# Altium schematic sheet EL.MBRD.T01.SchDoc
size A3; SheetNumber: 1; SheetTotal: 7
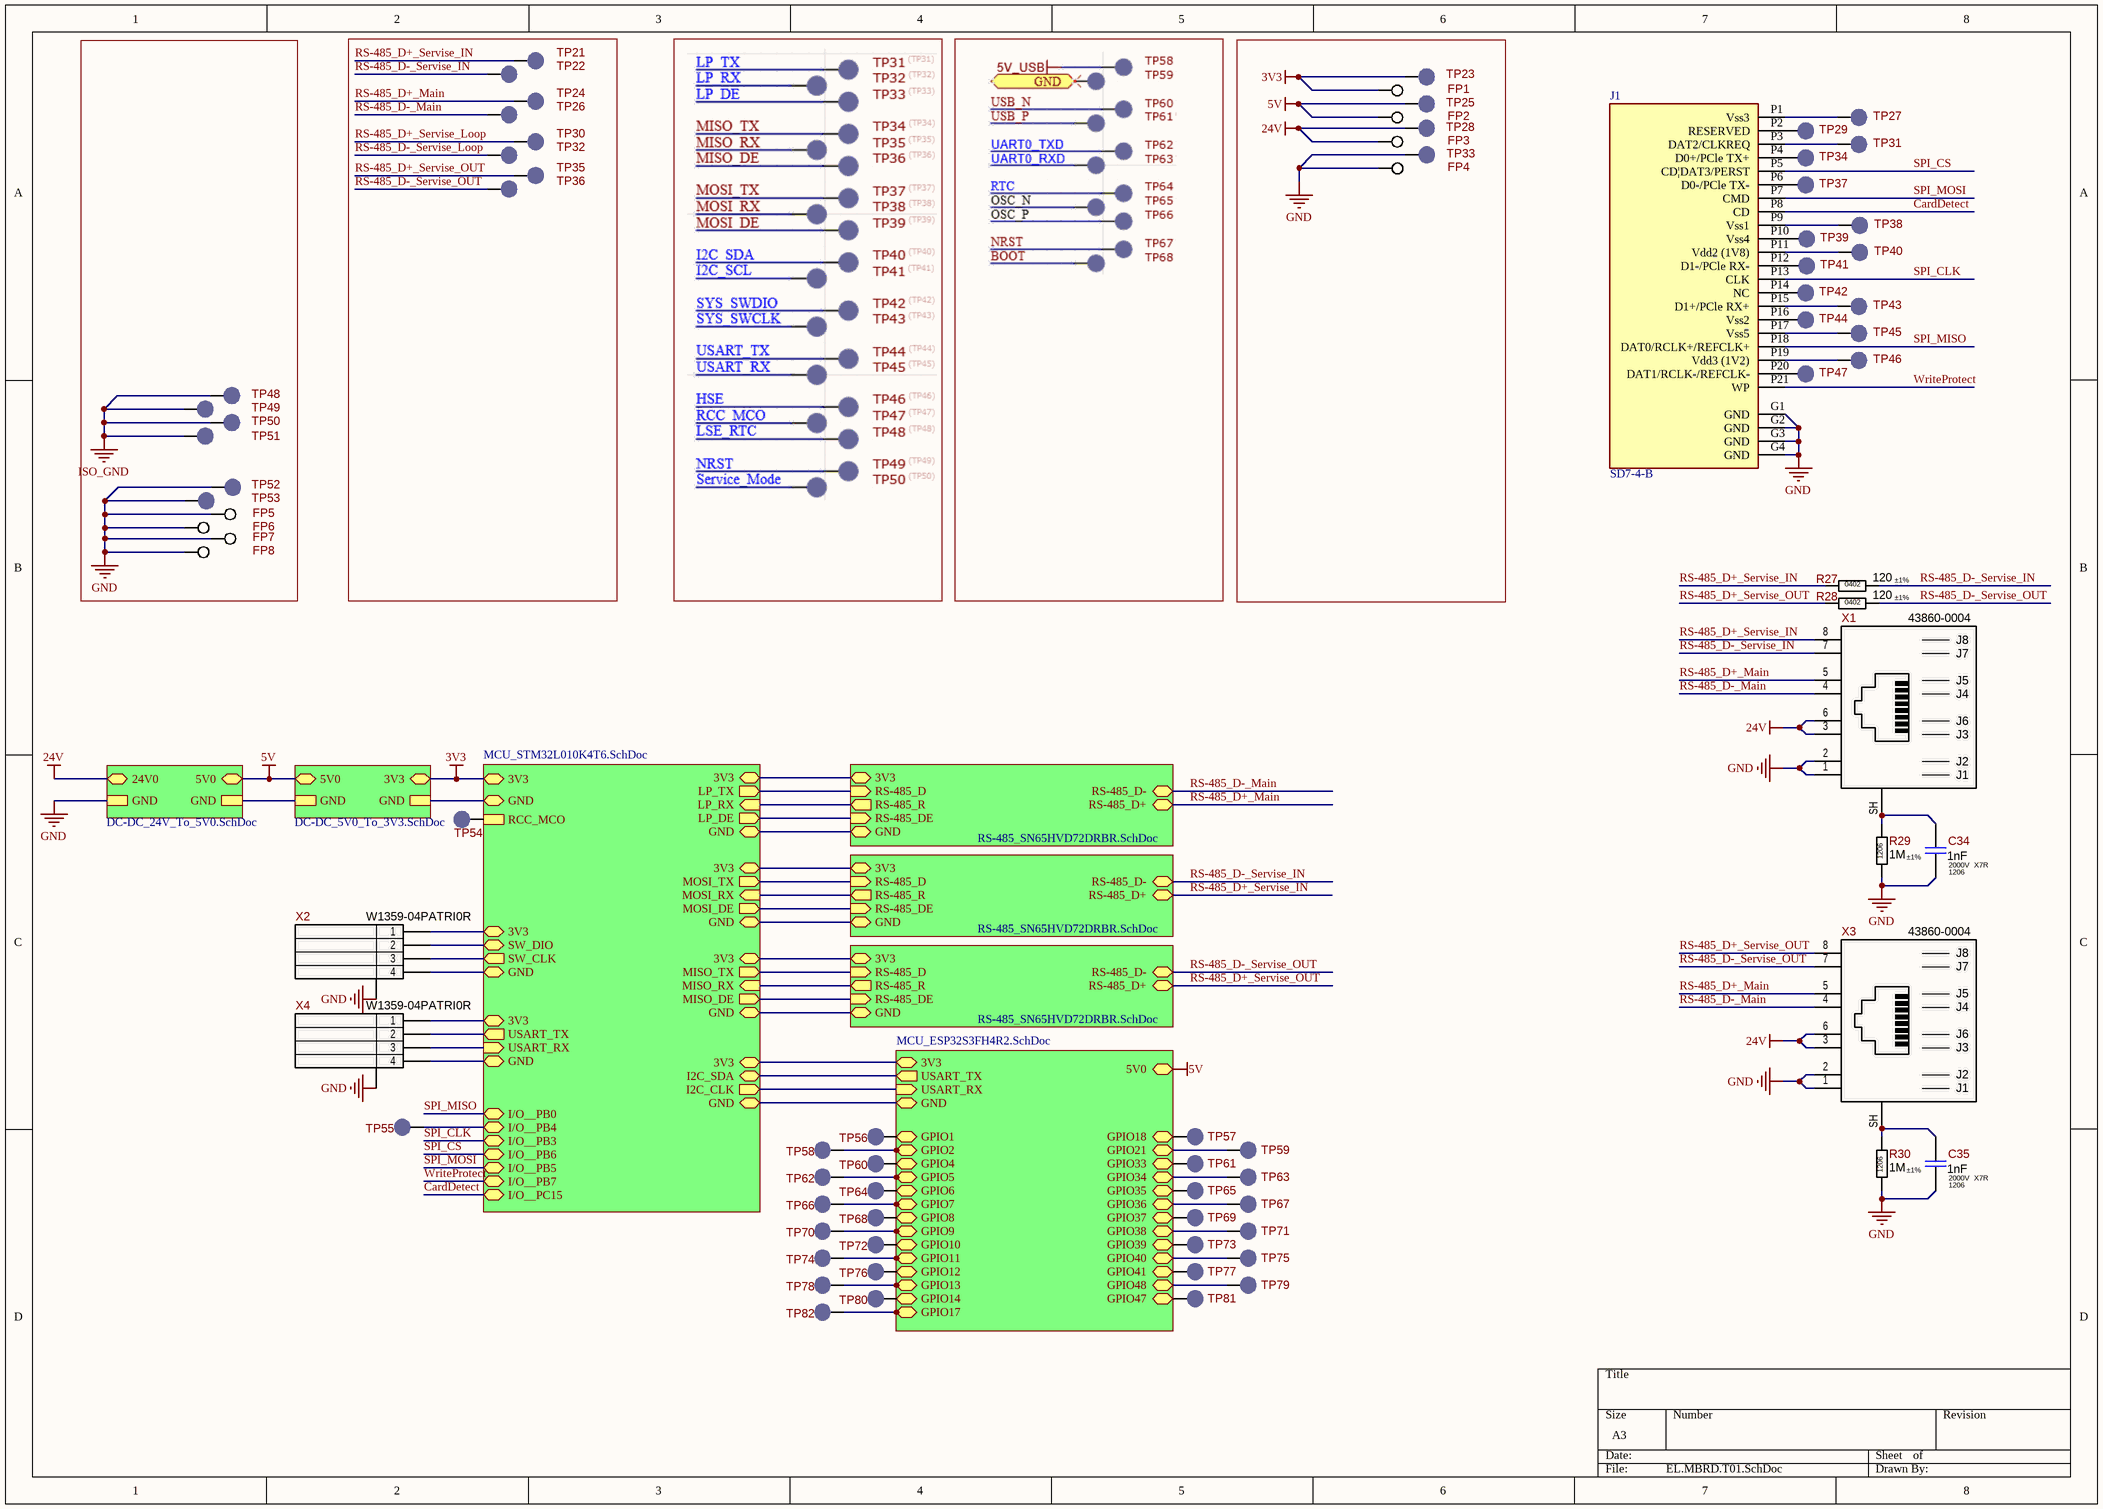
[diagram p0: EL.MBRD.T01.SchDoc]

## Parts
C34  Package: 1206  Voltage: 2000V  Dielectric Type: X7R  [CAP-1206(3216)X125T20]  (hidden comment: 1nF)
C35  Package: 1206  Voltage: 2000V  Dielectric Type: X7R  [CAP-1206(3216)X125T20]  (hidden comment: 1nF)
FP1  PAD-1.1mm  [PAD-1.1mm]  (value not drawn)  (no BOM)
FP2  PAD-1.1mm  [PAD-1.1mm]  (value not drawn)  (no BOM)
FP3  PAD-1.1mm  [PAD-1.1mm]  (value not drawn)  (no BOM)
FP4  PAD-1.1mm  [PAD-1.1mm]  (value not drawn)  (no BOM)
FP5  PAD-1.1mm  [PAD-1.1mm]  (value not drawn)  (no BOM)
FP6  PAD-1.1mm  [PAD-1.1mm]  (value not drawn)  (no BOM)
FP7  PAD-1.1mm  [PAD-1.1mm]  (value not drawn)  (no BOM)
FP8  PAD-1.1mm  [PAD-1.1mm]  (value not drawn)  (no BOM)
J1  SD7-4-B  [SAMESKY_SD7-4-B]
R27  Tolerance: ±1%  Package: 0402  [R_ANY_CHIP_0402_HI]  (hidden comment: 120)
R28  Tolerance: ±1%  Package: 0402  [R_ANY_CHIP_0402_HI]  (hidden comment: 120)
R29  Tolerance: ±1%  Package: 1206  [CHV1206-Series]  (hidden comment: 1M)
R30  Tolerance: ±1%  Package: 1206  [CHV1206-Series]  (hidden comment: 1M)
TP21  LED_LINK  [TP_SMD_2mm]  (value not drawn)  (no BOM)
TP22  LED_LINK  [TP_SMD_2mm]  (value not drawn)  (no BOM)
TP23  LED_LINK  [TP_SMD_2mm]  (value not drawn)  (no BOM)
TP24  LED_LINK  [TP_SMD_2mm]  (value not drawn)  (no BOM)
TP25  LED_LINK  [TP_SMD_2mm]  (value not drawn)  (no BOM)
TP26  LED_LINK  [TP_SMD_2mm]  (value not drawn)  (no BOM)
TP27  LED_LINK  [TP_SMD_2mm]  (value not drawn)  (no BOM)
TP28  LED_LINK  [TP_SMD_2mm]  (value not drawn)  (no BOM)
TP29  LED_LINK  [TP_SMD_2mm]  (value not drawn)  (no BOM)
TP30  LED_LINK  [TP_SMD_2mm]  (value not drawn)  (no BOM)
TP31  LED_LINK  [TP_SMD_2mm]  (value not drawn)  (no BOM)
TP32  LED_LINK  [TP_SMD_2mm]  (value not drawn)  (no BOM)
TP33  LED_LINK  [TP_SMD_2mm]  (value not drawn)  (no BOM)
TP34  LED_LINK  [TP_SMD_2mm]  (value not drawn)  (no BOM)
TP35  LED_LINK  [TP_SMD_2mm]  (value not drawn)  (no BOM)
TP36  LED_LINK  [TP_SMD_2mm]  (value not drawn)  (no BOM)
TP37  LED_LINK  [TP_SMD_2mm]  (value not drawn)  (no BOM)
TP38  LED_LINK  [TP_SMD_2mm]  (value not drawn)  (no BOM)
TP39  LED_LINK  [TP_SMD_2mm]  (value not drawn)  (no BOM)
TP40  LED_LINK  [TP_SMD_2mm]  (value not drawn)  (no BOM)
TP41  LED_LINK  [TP_SMD_2mm]  (value not drawn)  (no BOM)
TP42  LED_LINK  [TP_SMD_2mm]  (value not drawn)  (no BOM)
TP43  LED_LINK  [TP_SMD_2mm]  (value not drawn)  (no BOM)
TP44  LED_LINK  [TP_SMD_2mm]  (value not drawn)  (no BOM)
TP45  LED_LINK  [TP_SMD_2mm]  (value not drawn)  (no BOM)
TP46  LED_LINK  [TP_SMD_2mm]  (value not drawn)  (no BOM)
TP47  LED_LINK  [TP_SMD_2mm]  (value not drawn)  (no BOM)
TP48  LED_LINK  [TP_SMD_2mm]  (value not drawn)  (no BOM)
TP49  LED_LINK  [TP_SMD_2mm]  (value not drawn)  (no BOM)
TP50  LED_LINK  [TP_SMD_2mm]  (value not drawn)  (no BOM)
TP51  LED_LINK  [TP_SMD_2mm]  (value not drawn)  (no BOM)
TP52  LED_LINK  [TP_SMD_2mm]  (value not drawn)  (no BOM)
TP53  LED_LINK  [TP_SMD_2mm]  (value not drawn)  (no BOM)
TP54  LED_LINK  [TP_SMD_2mm]  (value not drawn)  (no BOM)
TP55  LED_LINK  [TP_SMD_2mm]  (value not drawn)  (no BOM)
TP56  LED_LINK  [TP_SMD_2mm]  (value not drawn)  (no BOM)
TP57  LED_LINK  [TP_SMD_2mm]  (value not drawn)  (no BOM)
TP58  LED_LINK  [TP_SMD_2mm]  (value not drawn)  (no BOM)
TP59  LED_LINK  [TP_SMD_2mm]  (value not drawn)  (no BOM)
TP60  LED_LINK  [TP_SMD_2mm]  (value not drawn)  (no BOM)
TP61  LED_LINK  [TP_SMD_2mm]  (value not drawn)  (no BOM)
TP62  LED_LINK  [TP_SMD_2mm]  (value not drawn)  (no BOM)
TP63  LED_LINK  [TP_SMD_2mm]  (value not drawn)  (no BOM)
TP64  LED_LINK  [TP_SMD_2mm]  (value not drawn)  (no BOM)
TP65  LED_LINK  [TP_SMD_2mm]  (value not drawn)  (no BOM)
TP66  LED_LINK  [TP_SMD_2mm]  (value not drawn)  (no BOM)
TP67  LED_LINK  [TP_SMD_2mm]  (value not drawn)  (no BOM)
TP68  LED_LINK  [TP_SMD_2mm]  (value not drawn)  (no BOM)
TP69  LED_LINK  [TP_SMD_2mm]  (value not drawn)  (no BOM)
TP70  LED_LINK  [TP_SMD_2mm]  (value not drawn)  (no BOM)
TP71  LED_LINK  [TP_SMD_2mm]  (value not drawn)  (no BOM)
TP72  LED_LINK  [TP_SMD_2mm]  (value not drawn)  (no BOM)
TP73  LED_LINK  [TP_SMD_2mm]  (value not drawn)  (no BOM)
TP74  LED_LINK  [TP_SMD_2mm]  (value not drawn)  (no BOM)
TP75  LED_LINK  [TP_SMD_2mm]  (value not drawn)  (no BOM)
TP76  LED_LINK  [TP_SMD_2mm]  (value not drawn)  (no BOM)
TP77  LED_LINK  [TP_SMD_2mm]  (value not drawn)  (no BOM)
TP78  LED_LINK  [TP_SMD_2mm]  (value not drawn)  (no BOM)
TP79  LED_LINK  [TP_SMD_2mm]  (value not drawn)  (no BOM)
TP80  LED_LINK  [TP_SMD_2mm]  (value not drawn)  (no BOM)
TP81  LED_LINK  [TP_SMD_2mm]  (value not drawn)  (no BOM)
TP82  LED_LINK  [TP_SMD_2mm]  (value not drawn)  (no BOM)
X1  43860-0004  [43860-0004]
X2  W1359-04PATRI0R  [W1359-04PATXI0R_DBG]
X3  43860-0004  [43860-0004]
X4  W1359-04PATRI0R  [W1359-04PATXI0R_DBG]

## Sub-sheets
LDO_3V3 = DC-DC_5V0_To_3V3.SchDoc: 3V3 (bidir), 5V0 (bidir), GND, GND
LDO_3V3 = DC-DC_24V_To_5V0.SchDoc: 5V0 (bidir), 24V0 (bidir), GND, GND
MCU = MCU_STM32L010K4T6.SchDoc: LP_TX (out), LP_RX (in), LP_DE (out), MISO_TX (out), MISO_RX (in), MISO_DE (out), MOSI_RX (in), MOSI_TX (out), MOSI_DE (out), I2C_SDA (bidir), I2C_CLK (out), SW_DIO (bidir), SW_CLK (out), USART_TX (out), USART_RX (in), RCC_MCO, I/O__PB0 (bidir), I/O__PB3 (bidir), I/O__PB4 (bidir), I/O__PB5 (bidir), I/O__PB6 (bidir), I/O__PB7 (bidir), I/O__PC15 (bidir), 3V3 (bidir), 3V3 (bidir), 3V3 (bidir), 3V3 (bidir), 3V3 (bidir), GND (bidir), GND (bidir), GND (bidir), GND (bidir), GND (bidir), GND (bidir), GND (bidir), 3V3 (bidir), 3V3 (bidir)
MCU = MCU_ESP32S3FH4R2.SchDoc: USART_TX (out), USART_RX (in), 5V0 (bidir), GPIO1 (bidir), GPIO4 (bidir), GPIO2 (bidir), GPIO6 (bidir), GPIO5 (bidir), GPIO7 (bidir), GPIO8 (bidir), 3V3 (bidir), GND (bidir), GPIO9 (bidir), GPIO11 (bidir), GPIO10 (bidir), GPIO13 (bidir), GPIO12 (bidir), GPIO14 (bidir), GPIO17 (bidir), GPIO18 (bidir), GPIO33 (bidir), GPIO21 (bidir), GPIO35 (bidir), GPIO34 (bidir), GPIO36 (bidir), GPIO37 (bidir), GPIO38 (bidir), GPIO40 (bidir), GPIO39 (bidir), GPIO48 (bidir), GPIO41 (bidir), GPIO47 (bidir)
RS-485 = RS-485_SN65HVD72DRBR.SchDoc: 3V3 (bidir), RS-485_D+ (bidir), RS-485_D- (bidir), RS-485_R (out), RS-485_D (in), RS-485_DE (in), GND (bidir)
RS-485 = RS-485_SN65HVD72DRBR.SchDoc: 3V3 (bidir), RS-485_D+ (bidir), RS-485_D- (bidir), RS-485_R (out), RS-485_D (in), RS-485_DE (in), GND (bidir)
RS-485 = RS-485_SN65HVD72DRBR.SchDoc: 3V3 (bidir), RS-485_D+ (bidir), RS-485_D- (bidir), RS-485_R (out), RS-485_D (in), RS-485_DE (in), GND (bidir)

## Nets
3V3: FP1.1 TP23.1 ; sheet LDO_3V3/3V3, sheet MCU/3V3
5V: FP2.1 TP25.1 ; sheet LDO_3V3/5V0, sheet LDO_3V3/5V0
24V: FP3.1 TP28.1 X1.3(TD3-) X1.6(CT) X3.3(TD3-) X3.6(CT) ; sheet LDO_3V3/24V0
GND: C34.2 C35.2 FP4.1 FP5.1 FP6.1 FP7.1 FP8.1 J1.G1(GND) J1.G2(GND) J1.G3(GND) J1.G4(GND) R29.2 R30.2 TP33.1 TP52.1 TP53.1 X1.1(TD4-) X1.2(TD4+) X2.MP(MountPad) X3.1(TD4-) X3.2(TD4+) X4.MP(MountPad) ; sheet LDO_3V3/GND
ISO_GND: TP48.1 TP49.1 TP50.1 TP51.1
CardDetect: J1.P8(CD) ; sheet MCU/I/O__PC15
RS-485_D+_Main: TP24.1 X1.5(CT) X3.5(CT) ; sheet RS-485/RS-485_D+
RS-485_D+_Servise_IN: R27.1 TP21.1 X1.8(TD2+) ; sheet RS-485/RS-485_D+
RS-485_D+_Servise_Loop: TP30.1
RS-485_D+_Servise_OUT: R28.1 TP35.1 X3.8(TD2+) ; sheet RS-485/RS-485_D+
RS-485_D-_Main: TP26.1 X1.4(TD3+) X3.4(TD3+) ; sheet RS-485/RS-485_D-
RS-485_D-_Servise_IN: R27.2 TP22.1 X1.7(TD2-) ; sheet RS-485/RS-485_D-
RS-485_D-_Servise_Loop: TP32.1
RS-485_D-_Servise_OUT: R28.2 TP36.1 X3.7(TD2-) ; sheet RS-485/RS-485_D-
SPI_CLK: J1.P13(CLK) ; sheet MCU/I/O__PB3
SPI_CS: J1.P5(CD|DAT3/PERST) ; sheet MCU/I/O__PB6
SPI_MISO: J1.P18(DAT0/RCLK+/REFCLK+) ; sheet MCU/I/O__PB0
SPI_MOSI: sheet MCU/I/O__PB5
WriteProtect: J1.P21(WP) ; sheet MCU/I/O__PB7
NetC34_1: C34.1 R29.1 X1.SH(Shield)
NetC35_1: C35.1 R30.1 X3.SH(Shield)
NetJ1_P1: J1.P1(Vss3) TP27.1
NetJ1_P3: J1.P3(DAT2/CLKREQ) TP31.1
NetJ1_P10: J1.P10(Vss4) TP39.1
NetJ1_P12: J1.P12(D1-/PCle_RX-) TP41.1
NetJ1_P15: J1.P15(D1+/PCle_RX+) TP43.1
NetJ1_P17: J1.P17(Vss5) TP45.1
NetJ1_P19: J1.P19(Vdd3_(1V2)) TP46.1
NetTP54_1: TP54.1 ; sheet MCU/RCC_MCO
NetTP55_1: TP55.1 ; sheet MCU/I/O__PB4
NetTP58_1: TP58.1 ; sheet MCU/GPIO2
NetTP62_1: TP62.1 ; sheet MCU/GPIO5
NetTP66_1: TP66.1 ; sheet MCU/GPIO7
NetTP70_1: TP70.1 ; sheet MCU/GPIO9
NetTP74_1: TP74.1 ; sheet MCU/GPIO11
NetTP78_1: TP78.1 ; sheet MCU/GPIO13
NetTP82_1: TP82.1 ; sheet MCU/GPIO17
NetX2_1: X2.1 ; sheet MCU/3V3
NetX2_2: X2.2 ; sheet MCU/SW_DIO
NetX2_3: X2.3 ; sheet MCU/SW_CLK
NetX2_4: X2.4 ; sheet MCU/GND
NetX4_1: X4.1 ; sheet MCU/3V3
NetX4_2: X4.2 ; sheet MCU/USART_TX
NetX4_3: X4.3 ; sheet MCU/USART_RX
NetX4_4: X4.4 ; sheet MCU/GND
(unnamed): sheet LDO_3V3/GND, sheet MCU/GND
(unnamed): sheet LDO_3V3/GND, sheet LDO_3V3/GND
(unnamed): sheet MCU/LP_TX, sheet RS-485/RS-485_D
(unnamed): sheet MCU/LP_RX, sheet RS-485/RS-485_R
(unnamed): sheet MCU/LP_DE, sheet RS-485/RS-485_DE
(unnamed): sheet MCU/MISO_TX, sheet RS-485/RS-485_D
(unnamed): sheet MCU/MISO_RX, sheet RS-485/RS-485_R
(unnamed): sheet MCU/MISO_DE, sheet RS-485/RS-485_DE
(unnamed): sheet MCU/MOSI_RX, sheet RS-485/RS-485_R
(unnamed): sheet MCU/MOSI_TX, sheet RS-485/RS-485_D
(unnamed): sheet MCU/MOSI_DE, sheet RS-485/RS-485_DE
(unnamed): sheet MCU/I2C_SDA, sheet MCU/USART_TX
(unnamed): sheet MCU/I2C_CLK, sheet MCU/USART_RX
(unnamed): sheet MCU/3V3, sheet RS-485/3V3
(unnamed): sheet MCU/3V3, sheet RS-485/3V3
(unnamed): sheet MCU/GND, sheet RS-485/GND
(unnamed): sheet MCU/GND, sheet RS-485/GND
(unnamed): sheet MCU/GND, sheet MCU/GND
(unnamed): sheet MCU/GND, sheet RS-485/GND
(unnamed): sheet MCU/3V3, sheet RS-485/3V3
(unnamed): sheet MCU/3V3, sheet MCU/3V3

Not connected (* = marked no-connect by the designer): J1 P2(RESERVED) P4(D0+/PCle_TX+) P6(D0-/PCle_TX-) P7(CMD) P9(Vss1) P11(Vdd2_(1V8)) P14(NC) P16(Vss2) P20(DAT1/RCLK-/REFCLK-); TP29 1; TP34 1; TP37 1; TP38 1; TP40 1; TP42 1; TP44 1; TP47 1; TP56 1; TP57 1; TP59 1; TP60 1; TP61 1; TP63 1; TP64 1; TP65 1; TP67 1; TP68 1; TP69 1; TP71 1; TP72 1; TP73 1; TP75 1; TP76 1; TP77 1; TP79 1; TP80 1; TP81 1

## Notes on the sheet
- Labels drawn without touching a wire or pin: 5V
- (in symbol 43860-0004) J8; J7; J5; J4; J6; J3; J2; J1

## Library data of the parts
C34 C35 = Capacitor-NonPolar: 1nF 2000V X7R ±10% 1206 Ceramic Capacitor RoHS; Part Number: CC1206KKX7RDBB102; Manufacturer: Yageo; Replacement: NONE; Value: 1nF; Part Type: Ceramic / X7R / 1206; Component Type: SMD; Temperature Range: -55°C ~ 125°C; Tolerance: ±10%; ComponentLink1URL: https://www.yageo.com/upload/media/product/products/datasheet/mlcc/UPY-NP0X7R_HV_1KV-to-3KV_11.pdf; Supplier 1: Digi-Key; Supplier Part Number 1: 311-1487-2-ND; ComponentLink1Description: Datasheet
FP1-FP8 = Pad: 1.1mm Pad for Plug-In or Receptacle; Manufacturer: NONE; Component Status: Released; Part Number: PAD-1.1mm; Component Type: PTH; Part Type: Pad; Temperature Range: NONE; ComponentLink1URL: NONE; Replacement: NONE; ComponentLink1Description: Datasheet; Price: NONE
J1 = SD7-4-B: 21 (18 + 3) Position Card Connector Secure Digital - SD Surface Mount, Right Angle Gold; MF: Same Sky (Formerly CUI Devices); Number of Contacts: 21 Contact; Current Rating: 500 mA; Insertion - Extraction Style: Push-Pull; Insulation Resistance: 1 GOhms; Voltage Rating: 30 V; MP: SD7-4-B; ComponentLink1Description: Datasheet; ComponentLink1URL: https://eu.mouser.com/datasheet/2/1628/sd7_4_b-3623532.pdf; Product: Card Connectors; Card Type: SD; Mounting Style: SMD/SMT; Height: 2.28 mm; Subcategory: Memory Connectors & Sockets; Part Number: SD7-4-B; Supplier 1: Mouser; Supplier Part Number 1: 179-SD7-4-B
R27 R28 = Resistor: 120 Ohms ±1% 1/16W 0402 Thick Film Resistor; Part Number: RC0402FR-07120RL; Manufacturer: Yageo; Power Rating: 0.062W; Voltage: 50V; Component Status: Released; Temperature Stability: ±100ppm/°C; Replacement: NONE; Value: 120; Component Type: SMD; Part Type: Thick Film; Temperature Range: -55°C ~ 155°C; ComponentLink1URL: https://eu.mouser.com/datasheet/2/447/PYu_RC_Group_51_RoHS_L_10-1664068.pdf; Price: 0.00065; ComponentLink1Description: Datasheet
R29 R30 = Resistor: 1 MOhms ±1%, 1/4W 1206 Thick Film Resistor; Part Number: CHV1206-FX-1004ELF; Manufacturer: Bourns; Power Rating: 0.25W; Voltage: 800V; Component Status: Released; Temperature Stability: ±100ppm/°C; Replacement: NONE; Value: 1M; Component Type: SMD; Part Type: Thick Film; Temperature Range: -55°C ~ 155°C; ComponentLink1URL: https://eu.mouser.com/datasheet/2/54/CHV-777595.pdf; Supplier 1: Mouser; Supplier Part Number 1: 652-CHV1206FX1004ELF; Price: 0.0173216; ComponentLink1Description: Datasheet
TP21-TP82 = Test-Point-SMD-1: Test Point SMD Pad 1.0mm/1.5mm/2mm; Part Number: TP-PAD-SMD; Replacement: NONE; Part Type: Test Point; Component Type: SMD; Temperature Range: NONE; ComponentLink1URL: NONE; ComponentLink1Description: Datasheet
X1 X3 = 43860-0004: RJ45 8P8C Shielded Cat 3 10 Base-T Connector; Manufacturer: Molex; Component Status: Released; Replacement: NONE; Part Number: 43860-0004; Part Type: RJ-45; Component Type: PTH; Temperature Range: -40°C ~ 85°C; ComponentLink1URL: https://www.molex.com/pdm_docs/sd/438600004_sd.pdf; Supplier 1: Mouser; Supplier Part Number 1: 538-43860-0004; Price: 2.1435; ComponentLink1Description: Datasheet
X2 X4 = General-4-Pin-MP: 1.25mm Wire-to-Board Header, Vertical, SMT, 4 pin; Manufacturer: Hsuan Mao Technology; Component Status: Released; Replacement: 53398-0471; Part Number: W1359-04PATRI0R; Part Type: Wire-to-Board / 1.25mm; Component Type: SMD; Temperature Range: -40°C ~ 85°C; Price: 0.06